# EAGLE schematic D_amplifier (EAGLE 9.6.2)
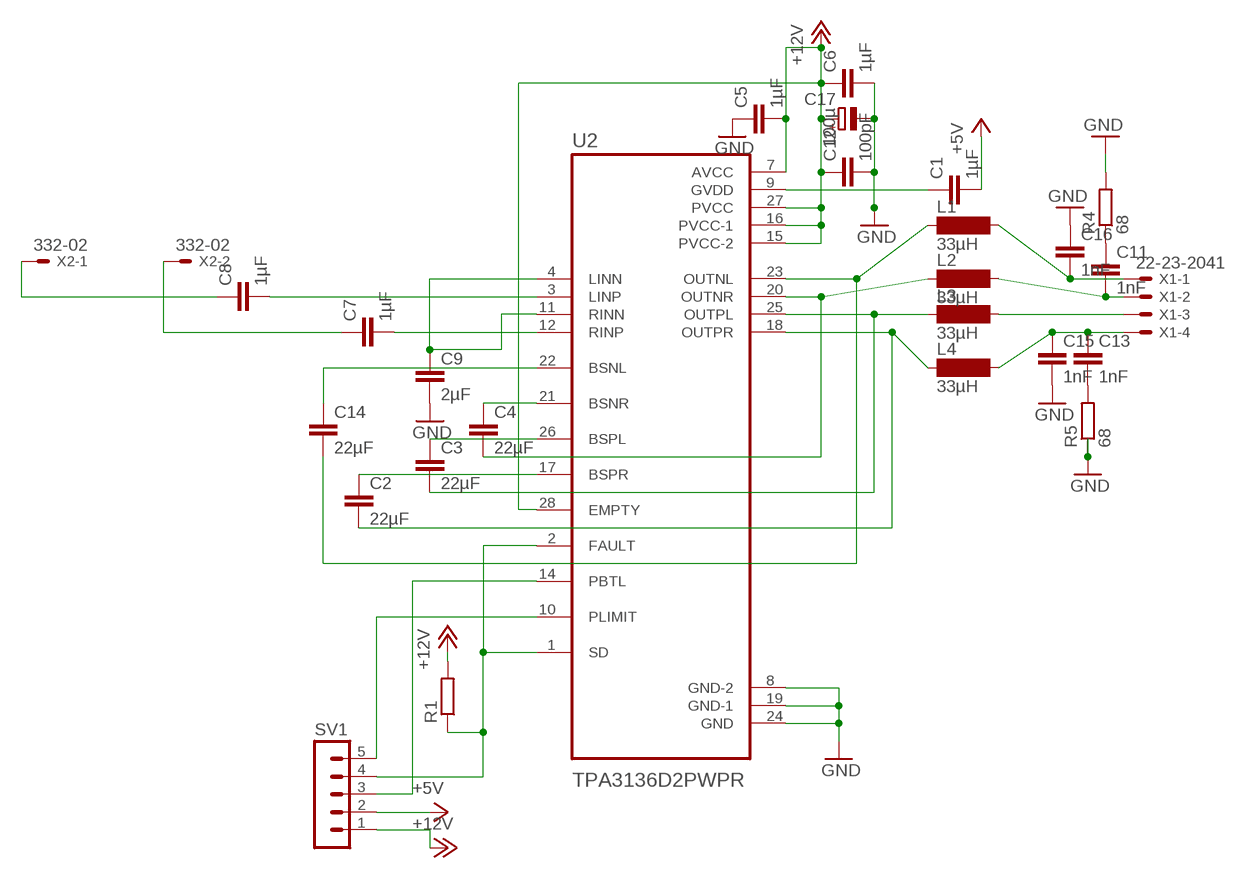
[diagram p0: schematic, sheet 1]

## Parts
C1  1µF  C-EUC0805K  [C0805K]
C2  22µF  C-EUC0805K  [C0805K]
C3  22µF  C-EUC0805K  [C0805K]
C4  22µF  C-EUC0805K  [C0805K]
C5  1µF  C-EUC0805K  [C0805K]
C6  1µF  C-EUC0805K  [C0805K]
C7  1µF  C-EUC0805K  [C0805K]
C8  1µF  C-EUC0805K  [C0805K]
C9  2µF  C-EUC0805K  [C0805K]
C11  1nF  C-EUC0805K  [C0805K]
C12  100pF  C-EUC0805K  [C0805K]
C13  1nF  C-EUC0805K  [C0805K]
C14  22µF  C-EUC0805K  [C0805K]
C15  1nF  C-EUC0805K  [C0805K]
C16  1nF  C-EUC0805K  [C0805K]
C17  100µ  CPOL-EU085CS-1AR  [085CS_1AR]
L1  33µH  SD12-680  [SD12-680]
L2  33µH  SD12-680  [SD12-680]
L3  33µH  SD12-680  [SD12-680]
L4  33µH  SD12-680  [SD12-680]
R1  R-EU_R0805  [R0805]
R4  68  R-EU_M0805  [M0805]
R5  68  R-EU_M0805  [M0805]
SV1  MA05-1  [MA05-1]
U2  TPA3136D2PWPR  [IC_TPS61196PWPRQ1]
X1  22-23-2041  [22-23-2041]
X2  332-02  [332-02]

## Nets
+5V: C1.2 SV1.2
+12V: C5.2 C6.1 C12.1 C17.+ R1.2 SV1.1 U2.7(AVCC) U2.15(PVCC-2) U2.16(PVCC-1) U2.27(PVCC) U2.28(EMPTY)
GND: C5.1 C6.2 C9.2 C12.2 C15.2 C16.1 C17.- R4.2 R5.1 U2.8(GND-2) U2.19(GND-1) U2.24(GND)
N$1: C7.2 U2.12(RINP)
N$2: C8.2 U2.3(LINP)
N$3: SV1.5 U2.10(PLIMIT)
N$4: C14.2 L1.1 U2.23(OUTNL)
N$5: C4.2 L2.1 U2.20(OUTNR)
N$6: C3.2 L3.1 U2.25(OUTPL)
N$7: C2.2 L4.1 U2.18(OUTPR)
N$8: R1.1 SV1.4 U2.1(SD) U2.2(FAULT)
N$9: SV1.3 U2.14(PBTL)
N$10: C4.1 U2.21(BSNR)
N$11: C3.1 U2.26(BSPL)
N$12: C2.1 U2.17(BSPR)
N$13: C14.1 U2.22(BSNL)
N$14: C1.1 U2.9(GVDD)
N$15: C7.1 X2.2
N$16: C8.1 X2.1
N$17: C9.1 U2.4(LINN) U2.11(RINN)
N$18: C16.2 L1.2 X1.1
N$19: C11.2 L2.2 X1.2
N$20: L3.2 X1.3
N$21: C13.1 C15.1 L4.2 X1.4
N$22: C13.2 R5.2
N$23: C11.1 R4.1

## Library data of the parts
C1-C9 C11-C16 = rcl:C-EU: CAPACITOR, European symbol; SPICEPREFIX: C
C17 = rcl:CPOL-EU: POLARIZED CAPACITOR, European symbol; SPICEPREFIX: C
L1-L4 = inductor-neosid:SD12: INDUCTOR nominal inductance; MF: BUSSMANN; MPN: SD12-680; OC_FARNELL: unknown; OC_NEWARK: 19K7201
R1 R4 R5 = rcl:R-EU_: RESISTOR, European symbol; SPICEPREFIX: R
SV1 = con-lstb:MA05-1: PIN HEADER; OC_FARNELL: unknown; OC_NEWARK: unknown
U2 = TPA3136D2PWPR:TPA3136D2PWPR: Check prices <https://pricing.snapeda.com/parts/TPA3136D2PWPR/Texas%20Instruments/view-part?ref=eda>; AVAILABILITY: Warning; DESCRIPTION: 10-W stereo, 20-W mono, 4.5- to 14.4-V, analog in Class-D audio amplifier w/ inductor free & low EMI 28-HTSSOP -40 to 85; MF: Texas Instruments; MP: TPA3136D2PWPR; PACKAGE: HTSSOP-28 Texas Instruments; PRICE: None; PURCHASE-URL: https://pricing.snapeda.com/search/part/TPA3136D2PWPR/?ref=eda
X1 = con-molex:22-23-2041: .100" (2.54mm) Center Header - 4 Pin; MF: MOLEX; MPN: 22-23-2041; OC_FARNELL: 1462920; OC_NEWARK: 38C0355
X2 = con-garry:332-02: 2 Pin - 2mm Dual Row Source: www.mpe-connector.de / garry_shortform_2012.pdf